# Altium schematic sheet 02_RSVD.SchDoc
size A3; DocumentNumber: 2; SheetNumber: 2; SheetTotal: 21
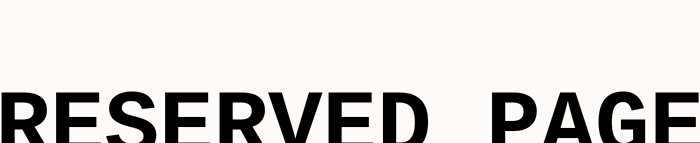
[diagram p0: 02_RSVD.SchDoc]

## Notes on the sheet
- RESERVED PAGE